# Altium schematic sheet PDM-S02-V00-BatteryProtection.SchDoc: Battery Input Protection and Sensing
size A3; DrawnBy: Zoe Goodward; Organization: QUT Motorsport; Address1: O-120, Gardens Point; Address2: 2 George Street; Address3: Brisbane, QLD 4000; Address4: Australia; DocumentNumber: 2; Revision: 01; SheetNumber: 2; SheetTotal: 9; Version: 01; Project: Power Distribution Module; PageSetup: Record=PageOptions|CenterHorizontal=True|CenterVertical=True|PrintScale=0.97|XCorrection=1.00|YCorrection=1.00|PrintKind=0|BorderSize=5000000|LeftOffset=0|BottomOffset=0|Orientation=2|PaperLength=1000|PaperWidth=1000|Scale=100|PaperSource=7|PrintQuality=-4|MediaType=1|DitherType=10|PaperKind=A4|PrintScaleMode=1
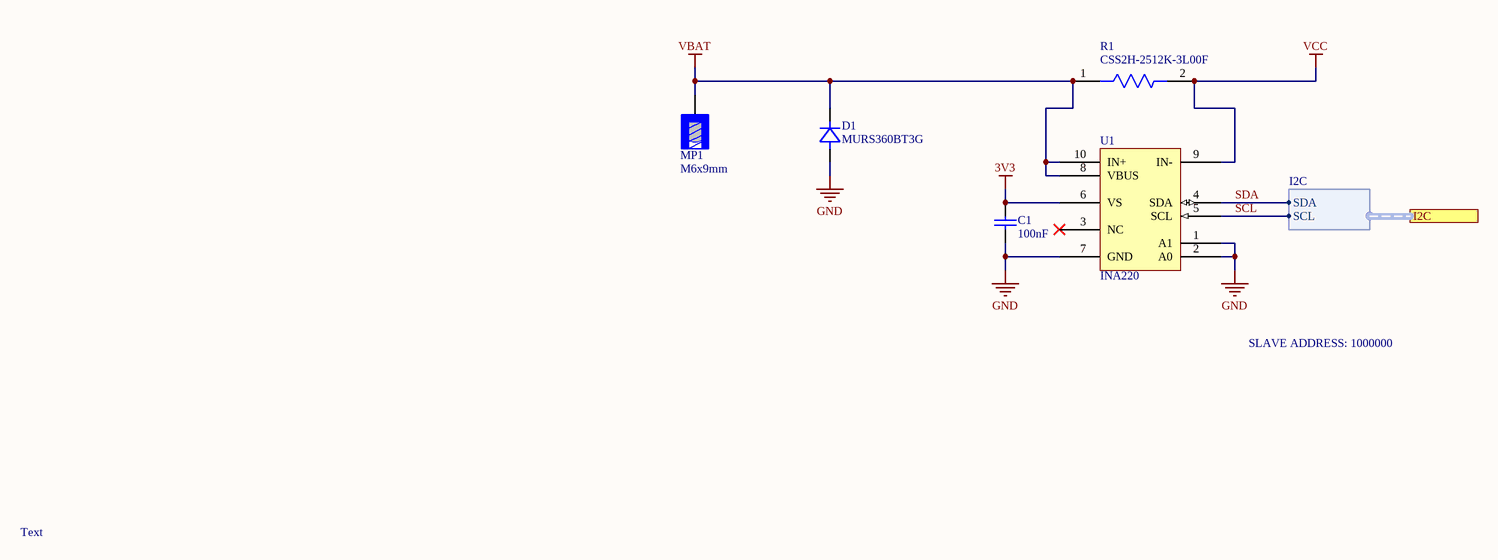
[diagram p0: PDM-S02-V00-BatteryProtection.SchDoc]

## Parts
C1  100nF  [Cap_Ceramic_0603]
D1  MURS360BT3G  [DO-214AA]
MP1  M6x9mm  [7461084_for chemical surfaces]
R1  CSS2H-2512K-3L00F  [CSS2H-2512]
U1  INA220  [VSSOP-10P]

## Ports
I2C (harness I2C)

## Harnesses
I2C: SDA, SCL

## Nets
3V3: C1.2 U1.6(VS)
GND: C1.1 D1.A U1.1(A1) U1.2(A0) U1.7(GND)
VBAT: D1.K MP1.1 R1.1(1_LOAD) U1.8(VBUS) U1.10(IN+)
VCC: R1.2(2_LOAD) U1.9(IN-)
SCL: U1.5(SCL) ; port I2C.SCL
SDA: U1.4(SDA) ; port I2C.SDA

Not connected (* = marked no-connect by the designer): U1 3(NC)*

## Notes on the sheet
- SLAVE ADDRESS: 1000000
- Text
- Revision History:
- Sheet Title:
- Rev
- Date
- Description
- Project:
- Size:
- Drawn By:
- A3
- Number:
- Revision:
- Sheet
- Version:
- of
- QUT Motorsport
- O-120, Gardens Point
- 2 George Street
- Brisbane, QLD 4000
- Australia
- Print Date:
- Print Time:
- File Name:

## Library data of the parts
C1 = 100nF 50V 5% X7R 0603: Capacitor, Ceramic, SMD, 100nF, 50V, 5%, X7R, 0603
D1 = MURS360BT3G: Diode Standard 600V 3A Surface Mount SMB; ComponentLink1Description: Datasheet; ComponentLink1URL: https://www.onsemi.com/pub/Collateral/MURS360BT3-D.PDF; ComponentLink2Description: Digikey; ComponentLink2URL: https://www.digikey.com.au/product-detail/en/on-semiconductor/MURS360BT3G/MURS360BT3GOSCT-ND/3462381
MP1 = 7461084: WP-BUTR Press-Fit with Internal thread, two rows, 10x10mm, 8 pins, M6x9mm, 160A; Pin Number: 8; Thread Length: 9mm; Thread: M6; Surface: Tin; ComponentLink1Description: Manufacturer; ComponentLink1URL: http://www.we-online.de; ComponentLink2Description: Datasheet; ComponentLink2URL: https://katalog.we-online.com/em/datasheet/7461084.pdf; Operating Temperature: -55 to +150degC; Height: 13.5mm; Material: Brass; Part Number: 7461084; Packaging: Bulk; Mounting Technology: Press-Fit; Rated Current: 160A; Publisher: Wurth Elektronik; Published Date: September 2019; Size: 10x10mm
R1 = CSS2H-2512K-3L00F: RES 0.003 OHM 1% 4W 2512; ComponentLink1Description: Datasheet; ComponentLink1URL: https://www.bourns.com/docs/product-datasheets/css2h-2512.pdf; ComponentLink2Description: Digikey; ComponentLink2URL: https://www.digikey.com.au/product-detail/en/bourns-inc/CSS2H-2512K-3L00F/CSS2H-2512K-3L00FCT-ND/6023724
U1 = INA220: INA220-Q1 Automotive Grade, 26-V, Bi-Directional, Zero-Drift, Low- or High-Side, I2C-Compatible Current/Power Monitor; ComponentLink1Description: Datasheet; ComponentLink1URL: https://www.ti.com/lit/ds/symlink/ina220-q1.pdf?HQS=TI-null-null-digikeymode-df-pf-null-wwe&ts=1596508842500; ComponentLink2Description: Digikey; ComponentLink2URL: https://www.digikey.com/product-detail/en/texas-instruments/INA220BQDGSRQ1/296-36593-1-ND/4341289